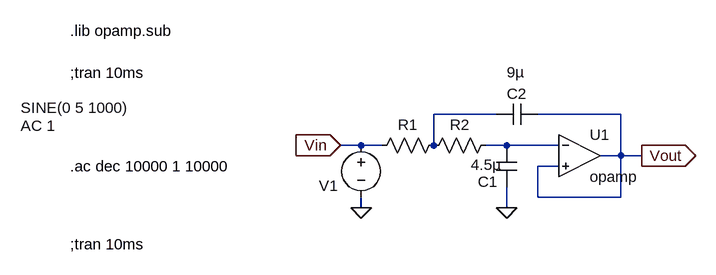
[diagram p0: schematic HP2order.asc]
HP2order.asc, the LTspice schematic file:
Version 4
SHEET 1 880 752
WIRE 272 256 176 256
WIRE 464 256 336 256
WIRE 64 304 32 304
WIRE 96 304 64 304
WIRE 176 304 176 256
WIRE 288 304 256 304
WIRE 368 304 288 304
WIRE 464 320 464 256
WIRE 464 320 432 320
WIRE 496 320 464 320
WIRE 368 336 336 336
WIRE 336 384 336 336
WIRE 464 384 464 320
WIRE 464 384 336 384
WIRE 64 400 64 384
WIRE 288 400 288 368
FLAG 288 400 0
FLAG 64 400 0
FLAG 496 320 Vout
IOPIN 496 320 Out
FLAG 32 304 Vin
IOPIN 32 304 In
SYMBOL res 192 288 R90
WINDOW 0 0 56 VBottom 2
WINDOW 3 44 56 Invisible 2
SYMATTR InstName R1
SYMATTR Value 100
SYMATTR SpiceLine tol=1 pwr=0.1
SYMBOL OpAmps\\opamp 400 256 R0
SYMATTR InstName U1
SYMBOL res 272 288 R90
WINDOW 0 0 56 VBottom 2
WINDOW 3 32 56 Invisible 2
SYMATTR InstName R2
SYMATTR Value 100
SYMATTR SpiceLine tol=1 pwr=0.1
SYMBOL voltage 64 288 R0
WINDOW 3 -524 -42 Left 2
WINDOW 123 -524 -14 Left 2
WINDOW 39 0 0 Left 0
WINDOW 0 -65 78 Left 2
SYMATTR Value SINE(0 5 1000)
SYMATTR Value2 AC 1
SYMATTR InstName V1
SYMBOL cap 272 304 R0
WINDOW 0 -28 56 Left 2
WINDOW 3 -39 30 Left 2
SYMATTR InstName C1
SYMATTR Value 4.5µ
SYMBOL cap 336 240 R90
WINDOW 0 0 32 VBottom 2
WINDOW 3 -33 34 VBottom 2
SYMATTR InstName C2
SYMATTR Value 9µ
TEXT -384 128 Left 2 !.lib opamp.sub
TEXT -384 192 Left 2 !;tran 10ms
TEXT -384 456 Left 2 !;tran 10ms
TEXT -384 336 Left 2 !.ac dec 10000 1 10000

The netlist it stands for:
* HP2order.asc
R1 N001 Vin 100 tol=1 pwr=0.1
XU1 N002 Vout Vout opamp Aol=100K GBW=10Meg  ; pins invin noninvin out
R2 N002 N001 100 tol=1 pwr=0.1
V1 Vin 0 SINE(0 5 1000) AC 1
C1 N002 0 4.5µ
C2 Vout N001 9µ
.lib opamp.sub
;tran 10ms
;tran 10ms
.ac dec 10000 1 10000
.backanno
.end